# Altium project UmSELv1.PRJPCB
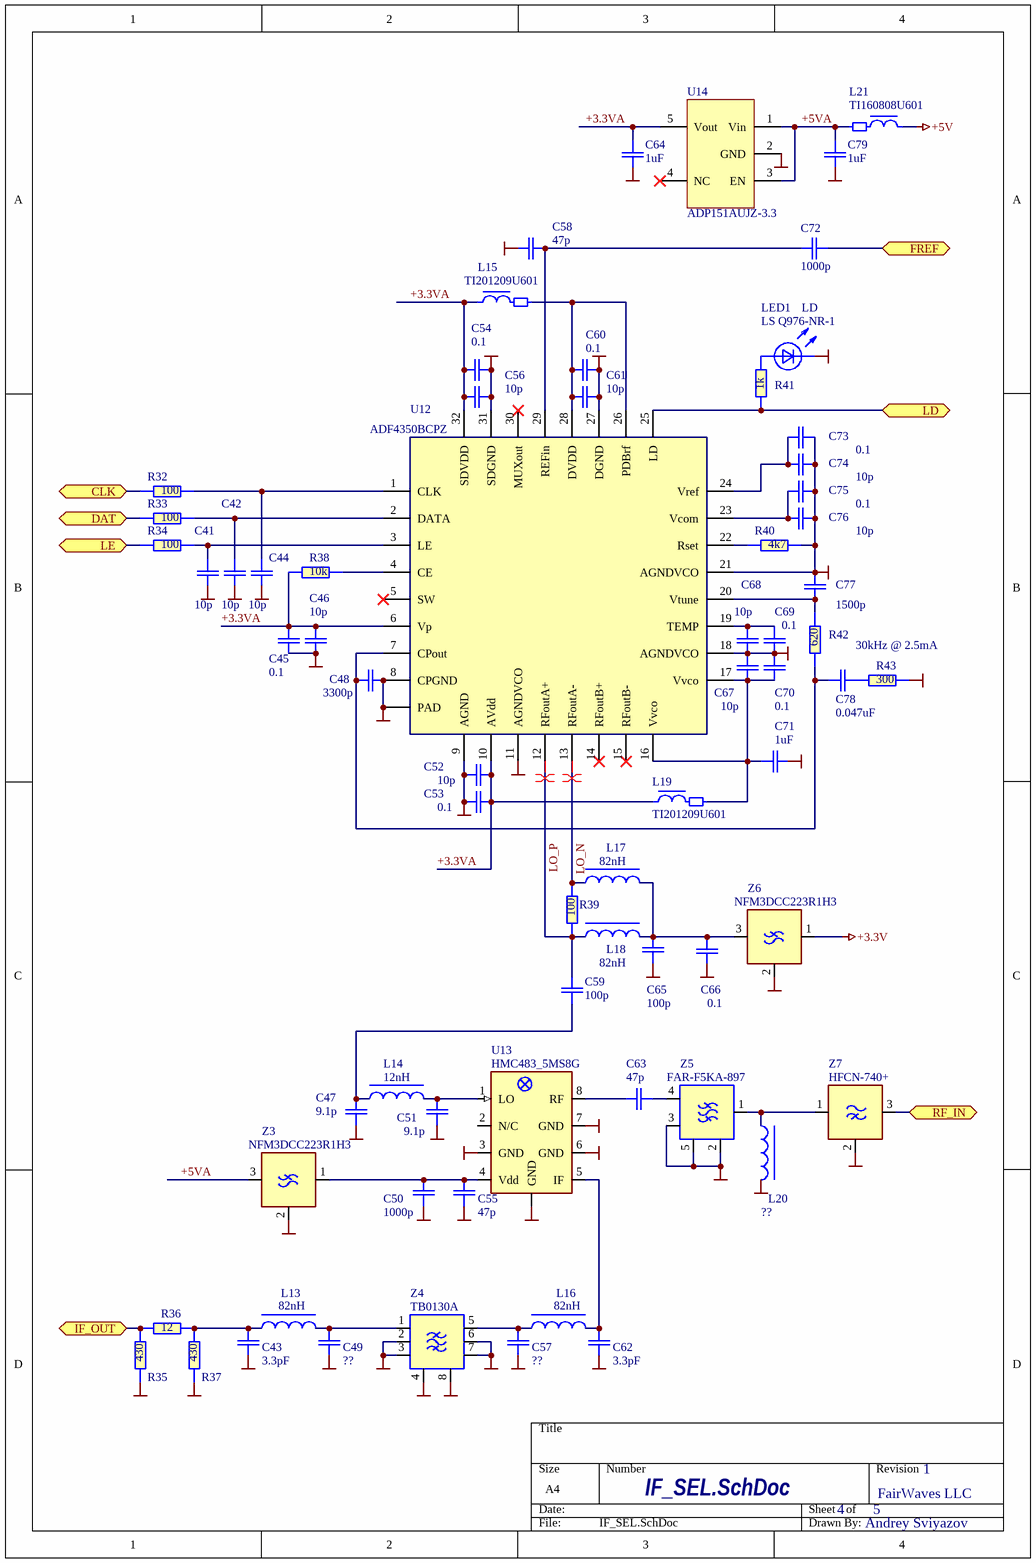
[diagram p0: IF_SEL.SchDoc]
3 sheets, 174 parts. Net scope: hierarchical (ports join the sheet entries above them; power ports are global).
Board file: UmSELv1.PcbDoc
Sheets:
  IF_SEL.SchDoc
  LNA_DIV.SchDoc
  Misc.SchDoc

## Sheet IF_SEL.SchDoc
size A4 portrait; CompanyName: FairWaves LLC; DrawnBy: Andrey Sviyazov; DocumentNumber: 4; Revision: 1; SheetNumber: 4; SheetTotal: 5

### Parts
C41  10p  [C0603-Phillips]
C42  10p  [C0603-Phillips]
C43  3.3pF  [C0603-Phillips]
C44  10p  [C0603-Phillips]
C45  0.1  [C0603-Phillips]
C46  10p  [C0603-Phillips]
C47  9.1p  [C0603-Phillips]
C48  3300p  [C0603-Phillips]
C49  ??  [C0603-Phillips]
C50  1000p  [C0603-Phillips]
C51  9.1p  [C0603-Phillips]
C52  10p  [C0603-Phillips]
C53  0.1  [C0603-Phillips]
C54  0.1  [C0603-Phillips]
C55  47p  [C0603-Phillips]
C56  10p  [C0603-Phillips]
C57  ??  [C0603-Phillips]
C58  47p  [C0603-Phillips]
C59  100p  [C0603-Phillips]
C60  0.1  [C0603-Phillips]
C61  10p  [C0603-Phillips]
C62  3.3pF  [C0603-Phillips]
C63  47p  [C0603-Phillips]
C64  1uF  [C0603-Phillips]
C65  100p  [C0603-Phillips]
C66  0.1  [C0603-Phillips]
C67  10p  [C0603-Phillips]
C68  10p  [C0603-Phillips]
C69  0.1  [C0603-Phillips]
C70  0.1  [C0603-Phillips]
C71  1uF  [C0603-Phillips]
C72  1000p  [C0603-Phillips]
C73  0.1  [C0603-Phillips]
C74  10p  [C0603-Phillips]
C75  0.1  [C0603-Phillips]
C76  10p  [C0603-Phillips]
C77  1500p  [C0603-Phillips]
C78  0.047uF  [C0603-Phillips]
C79  1uF  [C0603-Phillips]
L13  82nH  [TF160808-Phillips]
L14  12nH  [TF160808-Phillips]
L15  TI201209U601  [TI2012-Phillips]
L16  82nH  [TF160808-Phillips]
L17  82nH  [TF160808-Phillips]
L18  82nH  [TF160808-Phillips]
L19  TI201209U601  [TI2012-Phillips]
L20  ??  [TF160808-Phillips]
L21  TI160808U601  [Ti160808-Phillips]
LED1  LS Q976-NR-1  Misc: LD  [LED-0603y]
R32  100  [R0603-PHILLIPS]
R33  100  [R0603-PHILLIPS]
R34  100  [R0603-PHILLIPS]
R35  430  [R0603-PHILLIPS]
R36  12  [R0603-PHILLIPS]
R37  430  [R0603-PHILLIPS]
R38  10k  [R0603-PHILLIPS]
R39  100  [R0603-PHILLIPS]
R40  4k7  [R0603-PHILLIPS]
R41  1k  [R0603-PHILLIPS]
R42  620  [R0603-PHILLIPS]
R43  300  [R0603-PHILLIPS]
U12  ADF4350BCPZ  [CP-32-2]
U13  HMC483_5MS8G  [MS8G]
U14  ADP151AUJZ-3.3  [SOT-23-5[3.1x1.8/0.95]]
Z3  NFM3DCC223R1H3  [NFM3DC]
Z4  TB0130A  [DCC8_5x5]
Z5  FAR-F5KA-897  [SAW-1.4x1x0.5mm]
Z6  NFM3DCC223R1H3  [NFM3DC]
Z7  HFCN-740+  [LFCN-HFCN]

### Ports
CLK, DAT, FREF, IF_OUT, LD, LE, RF_IN

### Nets
+3.3V: Z6.1
+5V: L21.1
GND: C41.1 C42.1 C43.1 C44.1 C45.1 C46.1 C47.2 C48.1 C49.1 C50.2 C51.2 C52.2 C53.2 C54.2 C55.2 C56.2 C57.1 C58.1 C60.2 C61.2 C62.1 C64.1 C65.2 C66.1 C67.2 C68.1 C69.1 C70.2 C71.1 C73.2 C74.2 C75.2 C76.2 C77.2 C79.1 L20.2 LED1.1(K) R35.1 R37.1 R40.2 R43.2 U12.0(PAD) U12.8(CPGND) U12.9(AGND) U12.11(AGNDVCO) U12.18(AGNDVCO) U12.21(AGNDVCO) U12.27(DGND) U12.31(SDGND) U13.0(GND) U13.3(GND) U13.6(GND) U13.7(GND) U14.2(GND) Z3.2 Z4.2(In2) Z4.3(In3) Z4.4(Gnd) Z4.6(Out2) Z4.7(Out3) Z4.8(Gnd) Z5.2(GND) Z5.3(~{Out}) Z5.5(GND) Z6.2 Z7.2
+3.3VA: C45.2 C46.2 C52.1 C53.1 C54.1 C56.1 C64.2 L15.1 L19.1 R38.1 U12.6(Vp) U12.10(AVdd) U12.32(SDVDD) U14.5(Vout)
+5VA: C79.2 L21.2 U14.1(Vin) U14.3(EN) Z3.3
CLK: R32.1 ; port CLK
DAT: R33.1 ; port DAT
FREF: C72.2 ; port FREF
IF_OUT: R35.2 R36.1 ; port IF_OUT
LD: R41.1 U12.25(LD) ; port LD
LE: R34.1 ; port LE
LO_N: L17.1 R39.2 U12.13(RFoutA-)
LO_P: C59.1 L18.1 R39.1 U12.12(RFoutA+)
RF_IN: Z7.3 ; port RF_IN
NetC41_2: C41.2 R34.2 U12.3(LE)
NetC42_2: C42.2 R33.2 U12.2(DATA)
NetC43_2: C43.2 L13.1 R36.2 R37.2
NetC44_2: C44.2 R32.2 U12.1(CLK)
NetC47_1: C47.1 C59.2 L14.2
NetC48_2: C48.2 C78.2 R42.1 U12.7(CPout)
NetC49_2: C49.2 L13.2 Z4.1(IN1)
NetC50_1: C50.1 C55.1 U13.4(Vdd) Z3.1
NetC51_1: C51.1 L14.1 U13.1(LO)
NetC57_2: C57.2 L16.1 Z4.5(Out1)
NetC58_2: C58.2 C72.1 U12.29(REFin)
NetC60_1: C60.1 C61.1 L15.2 U12.26(PDBrf) U12.28(DVDD)
NetC62_2: C62.2 L16.2 U13.5(IF)
NetC63_1: C63.1 U13.8(RF)
NetC63_2: C63.2 Z5.4(Out)
NetC65_1: C65.1 C66.2 L17.2 L18.2 Z6.3
NetC67_1: C67.1 C70.1 C71.2 L19.2 U12.16(Vvco) U12.17(Vvco)
NetC68_2: C68.2 C69.2 U12.19(TEMP)
NetC73_1: C73.1 C74.1 U12.24(Vref)
NetC75_1: C75.1 C76.1 U12.23(Vcom)
NetC77_1: C77.1 R42.2 U12.20(Vtune)
NetC78_1: C78.1 R43.1
NetL20_1: L20.1 Z5.1(IN) Z7.1
NetLED1_2: LED1.2(A) R41.2
NetR38_2: R38.2 U12.4(CE)
NetR40_1: R40.1 U12.22(Rset)

Not connected (* = marked no-connect by the designer): U12 5(SW)* 14(RFoutB+)* 15(RFoutB-)* 30(MUXout)*; U13 2(N/C); U14 4(NC)*

### Layout directives
differential pair: LO_N, LO_P

### Notes on the sheet
- 30kHz @ 2.5mA

### Library data of the parts
C41-C44 C46-C52 C55-C59 C61-C63 C65 C67 C68 C72 C74 C76 C77 = C0603: Capacitor; Manufacturer: MURATA; Tolerance: 20%; Name: SMD0603; U/P/TKE: NP0
  C41 C42 C44 C46 C52 C56 C61 C67 C68 C74 C76: Value: 10p
  C43 C62: Value: 3.3pF
  C47 C51: Value: 9.1p
  C48: Value: 3300p
  C49 C57: Value: ??
  C50 C72: Value: 1000p
  C55 C58 C63: Value: 47p
  C59 C65: Value: 100p
  C77: Value: 1500p
C45 C53 C54 C60 C64 C66 C69-C71 C73 C75 C79 = C0603: Capacitor; Manufacturer: MURATA; Tolerance: 20%; Name: SMD0603; U/P/TKE: Y5V
  C45 C53 C54 C60 C66 C69 C70 C73 C75: Value: 0.1
  C64 C71 C79: Value: 1uF
C78 = C0603: Capacitor; Manufacturer: MURATA; Tolerance: 20%; Name: SMD0603; U/P/TKE: X5R; Value: 0.047uF
L13 L14 L16-L18 L20 = TF160808: Coil; Manufacturer: SMD; Name: TF160808
  L13 L16-L18: Value: 82nH
  L14: Value: 12nH
  L20: Value: ??
L15 L19 = TI2012_1: Choke; Manufacturer: MURATA; Name: TI201209U601; Value: *
L21 = TI160808: Choke; Manufacturer: MURATA; Name: TI160808U601; Value: *
LED1 = LED0603: LED SMD; Manufacturer: OSRAM Opto Semi; Name: LS Q976-NR-1
R32-R43 = R0603: Resistor; Manufacturer: YAGEO; Tolerance: 5%; Name: SMD0603; U/P/TKE: 0.1W
  R32-R34 R39: Value: 100
  R35 R37: Value: 430
  R36: Value: 12
  R38: Value: 10k
  R40: Value: 4k7
  R41: Value: 1k
  R42: Value: 620
  R43: Value: 300
U12 = ADF4350BCPZ: IC; Manufacturer: Analog Devices; Misc: RF Synthesizer with VCO; Swap: No; Name: ADF4350BCPZ
U13 = HMC483_5MS8G: IC; Manufacturer: Hittite; Swap: No; Misc: High IP3 Mixer with  LO Amp; Name: HMC483_5MS8G
U14 = ADP151AUJZ: IC; Manufacturer: AD; Name: ADP151AUJZ-3.3
Z3 Z6 = NFM3DC: EMI_FILTER; Manufacturer: Murata; Value: 22nF; PDF: D:\Proj\Components\Murata\EMI Suppression Filters.pdf; Name: NFM3DCC223R1H3; Misc: EMI_FILTER
Z4 = SAW 5x5-8 SMD: SAW filter; Manufacturer: Tai-SAW; Misc: Low-Loss IF Filter for Mobile Communication; Name: TB0130A
Z5 = SAW 1.4x1.0-5 SMD: SAW Filter; Manufacturer: Taiyo Yuden; Misc: Low-Loss Filter for Mobile Communication; Name: FAR-F5KA-897
Z7 = HFCN-2700: High pass filter; Manufacturer: MiniCircuits; Misc: HPF-740МГц; Name: HFCN-740+; Value: HFCN-740+

## Sheet LNA_DIV.SchDoc
size A4 portrait; CompanyName: FairWaves LLC; DrawnBy: Andrey Sviyazov; DocumentNumber: 3; Revision: 1; SheetNumber: 3; SheetTotal: 5
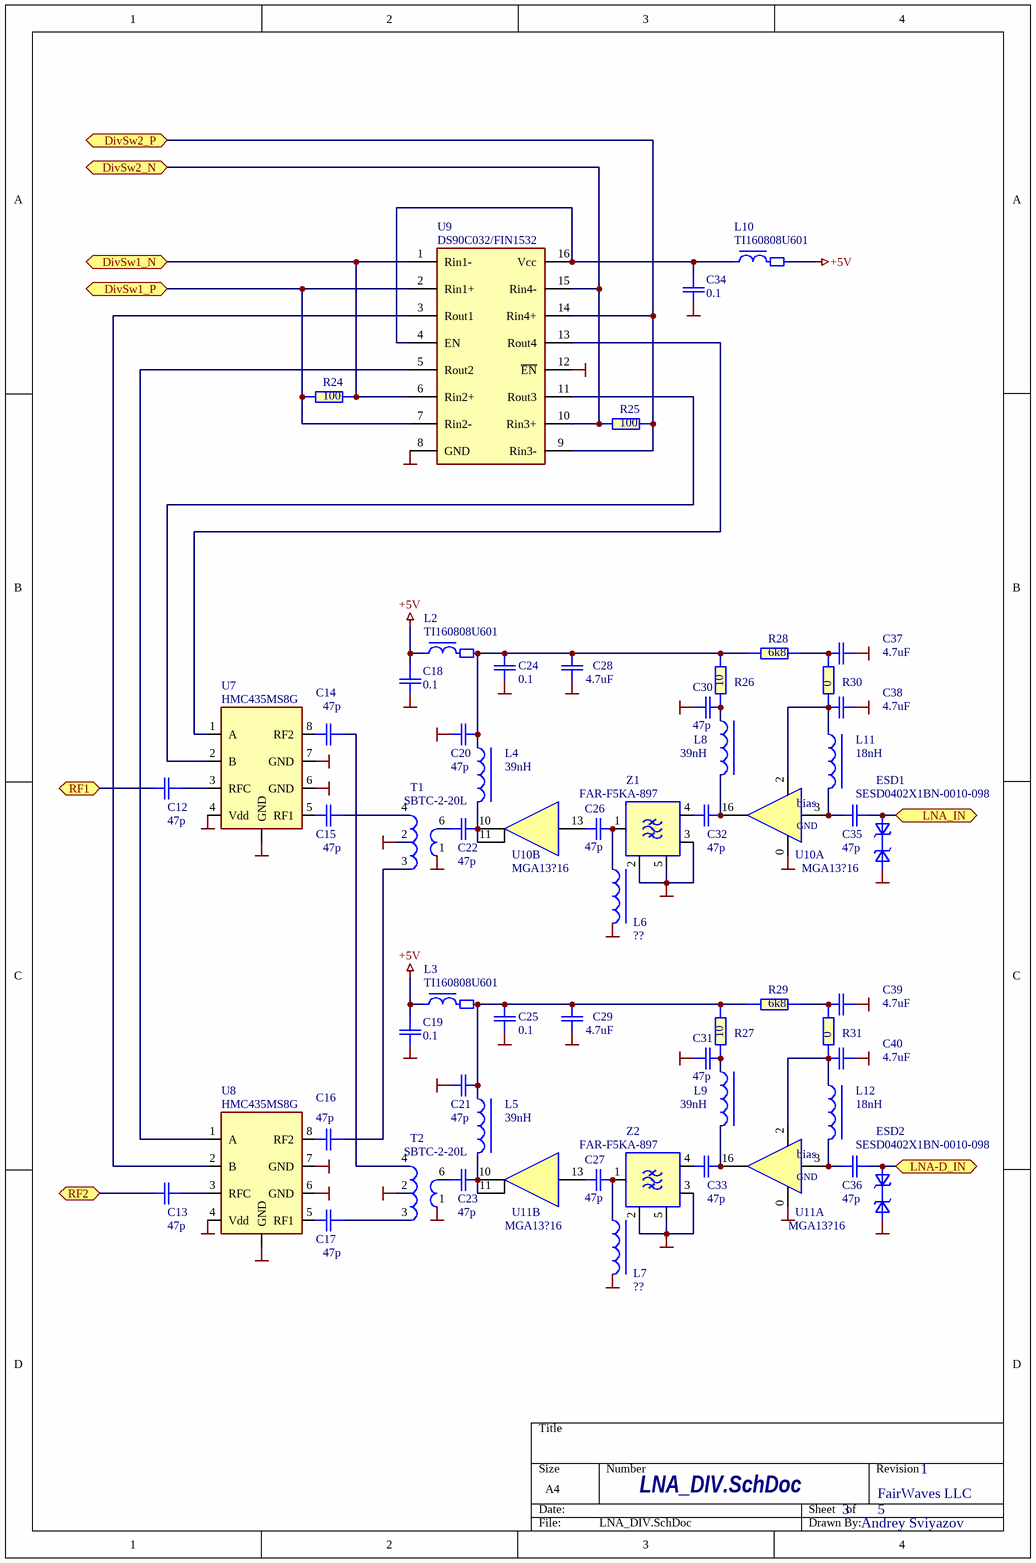
[diagram p1: LNA_DIV.SchDoc]

### Parts
C12  47p  [C0603-PHILLIPS]
C13  47p  [C0603-PHILLIPS]
C14  47p  [C0603-PHILLIPS]
C15  47p  [C0603-PHILLIPS]
C16  47p  [C0603-PHILLIPS]
C17  47p  [C0603-PHILLIPS]
C18  0.1  [C0603-Phillips]
C19  0.1  [C0603-Phillips]
C20  47p  [C0603-PHILLIPS]
C21  47p  [C0603-PHILLIPS]
C22  47p  [C0603-PHILLIPS]
C23  47p  [C0603-PHILLIPS]
C24  0.1  [C0603-Phillips]
C25  0.1  [C0603-Phillips]
C26  47p  [C0603-PHILLIPS]
C27  47p  [C0603-PHILLIPS]
C28  4.7uF  [C0603-Phillips]
C29  4.7uF  [C0603-Phillips]
C30  47p  [C0603-PHILLIPS]
C31  47p  [C0603-PHILLIPS]
C32  47p  [C0603-PHILLIPS]
C33  47p  [C0603-PHILLIPS]
C34  0.1  [C0603-Phillips]
C35  47p  [C0603-PHILLIPS]
C36  47p  [C0603-PHILLIPS]
C37  4.7uF  [C0603-Phillips]
C38  4.7uF  [C0603-Phillips]
C39  4.7uF  [C0603-Phillips]
C40  4.7uF  [C0603-Phillips]
ESD1  SESD0402X1BN-0010-098  [R0402-Phillips]
ESD2  SESD0402X1BN-0010-098  [R0402-Phillips]
L2  TI160808U601  [Ti160808-Phillips]
L3  TI160808U601  [Ti160808-Phillips]
L4  39nH  [TF160808-Phillips]
L5  39nH  [TF160808-Phillips]
L6  ??  [TF160808-Phillips]
L7  ??  [TF160808-Phillips]
L8  39nH  [TF160808-Phillips]
L9  39nH  [TF160808-Phillips]
L10  TI160808U601  [Ti160808-Phillips]
L11  18nH  [TF160808-Phillips]
L12  18nH  [TF160808-Phillips]
R24  100  [R0603-PHILLIPS]
R25  100  [R0603-PHILLIPS]
R26  10  [R0603-PHILLIPS]
R27  10  [R0603-PHILLIPS]
R28  6k8  [R0603-PHILLIPS]
R29  6k8  [R0603-PHILLIPS]
R30  0  [R0603-PHILLIPS]
R31  0  [R0603-PHILLIPS]
T1  SBTC-2-20L  [AT1030]
T2  SBTC-2-20L  [AT1030]
U7  HMC435MS8G  [MS8G]
U8  HMC435MS8G  [MS8G]
U9  DS90C032/FIN1532  [SOIC16]
U10  MGA13?16  [MGA13x16(GND NC Legs)]  (parts A,B of 2)
U11  MGA13?16  [MGA13x16(GND NC Legs)]  (parts A,B of 2)
Z1  FAR-F5KA-897  [SAW-1.4x1x0.5mm]
Z2  FAR-F5KA-897  [SAW-1.4x1x0.5mm]

### Ports
DivSw1_N, DivSw1_P, DivSw2_N, DivSw2_P, LNA-D_IN, LNA_IN, RF1, RF2

### Nets
+5V: C18.2 C19.2 L2.1 L3.1 L10.2
GND: C18.1 C19.1 C20.1 C21.1 C24.1 C25.1 C28.1 C29.1 C30.2 C31.2 C34.1 C37.2 C38.2 C39.2 C40.2 ESD1.1(A1) ESD2.1(A1) L6.2 L7.2 T1.1 T1.2 T2.1 T2.2 U7.0(GND) U7.4(Vdd) U7.6(GND) U7.7(GND) U8.0(GND) U8.4(Vdd) U8.6(GND) U8.7(GND) U9.8(GND) U9.12(~{EN}) U10.0(GND) U11.0(GND) Z1.2(GND) Z1.3(~{Out}) Z1.5(GND) Z2.2(GND) Z2.3(~{Out}) Z2.5(GND)
DivSw1_N: R24.2 U9.1(Rin1-) U9.6(Rin2+) ; port DivSw1_N
DivSw1_P: R24.1 U9.2(Rin1+) U9.7(Rin2-) ; port DivSw1_P
DivSw2_N: R25.1 U9.10(Rin3+) U9.15(Rin4-) ; port DivSw2_N
DivSw2_P: R25.2 U9.9(Rin3-) U9.14(Rin4+) ; port DivSw2_P
LNA-D_IN: C36.2 ESD2.2(A2) ; port LNA-D_IN
LNA_IN: C35.2 ESD1.2(A2) ; port LNA_IN
RF1: C12.1 ; port RF1
RF2: C13.1 ; port RF2
NetC12_2: C12.2 U7.3(RFC)
NetC13_2: C13.2 U8.3(RFC)
NetC14_1: C14.1 U7.8(RF2)
NetC14_2: C14.2 T2.4
NetC15_1: C15.1 U7.5(RF1)
NetC15_2: C15.2 T1.4
NetC16_1: C16.1 U8.8(RF2)
NetC16_2: C16.2 T1.3
NetC17_1: C17.1 U8.5(RF1)
NetC17_2: C17.2 T2.3
NetC20_2: C20.2 C24.2 C28.2 L2.2 L4.1 R26.2 R28.1
NetC21_2: C21.2 C25.2 C29.2 L3.2 L5.1 R27.2 R29.1
NetC22_1: C22.1 T1.6
NetC22_2: C22.2 L4.2 U10.10(Out2/VDD) U10.11(Out2/VDD)
NetC23_1: C23.1 T2.6
NetC23_2: C23.2 L5.2 U11.10(Out2/VDD) U11.11(Out2/VDD)
NetC26_1: C26.1 U10.13(In2)
NetC26_2: C26.2 L6.1 Z1.1(IN)
NetC27_1: C27.1 U11.13(In2)
NetC27_2: C27.2 L7.1 Z2.1(IN)
NetC30_1: C30.1 L8.1 R26.1
NetC31_1: C31.1 L9.1 R27.1
NetC32_1: C32.1 Z1.4(Out)
NetC32_2: C32.2 L8.2 U10.16(Out1/VDD)
NetC33_1: C33.1 Z2.4(Out)
NetC33_2: C33.2 L9.2 U11.16(Out1/VDD)
NetC34_2: C34.2 L10.1 U9.4(EN) U9.16(Vcc)
NetC35_1: C35.1 L11.2 U10.3(In1)
NetC36_1: C36.1 L12.2 U11.3(In1)
NetC37_1: C37.1 R28.2 R30.2
NetC38_1: C38.1 L11.1 R30.1 U10.2(BIAS)
NetC39_1: C39.1 R29.2 R31.2
NetC40_1: C40.1 L12.1 R31.1 U11.2(BIAS)
NetU7_1: U7.1(A) U9.13(Rout4)
NetU7_2: U7.2(B) U9.11(Rout3)
NetU8_1: U8.1(A) U9.5(Rout2)
NetU8_2: U8.2(B) U9.3(Rout1)

### Notes on the sheet
- (in symbol MGA13116, part A) bias

### Library data of the parts
C12-C17 C20-C23 C26 C27 C30-C33 C35 C36 = C0603: as C41 on sheet IF_SEL; Value: 47p
C18 C19 C24 C25 C28 C29 C34 C37-C40 = C0603: as C45 on sheet IF_SEL
  C18 C19 C24 C25 C34: Value: 0.1
  C28 C29 C37-C40: Value: 4.7uF
ESD1 ESD2 = SESD0402X: ESD diod bi-directional; Manufacturer: Tyco Electronics Corp; U/P/TKE: 9.8V; Name: SESD0402X1BN-0010-098
L2 L3 L10 = TI160808: Choke; Manufacturer: MURATA; Name: TI160808U601; Value: *
L4-L9 L11 L12 = TF160808: Coil; Manufacturer: SMD; Name: TF160808
  L4 L5 L8 L9: Value: 39nH
  L6 L7: Value: ??
  L11 L12: Value: 18nH
R24-R31 = R0603: as R32 on sheet IF_SEL
  R24 R25: Value: 100
  R26 R27: Value: 10
  R28 R29: Value: 6k8
  R30 R31: Value: 0
T1 T2 = SBTC-2-10L: Transformer; Manufacturer: Mini-Cirquits; Name: SBTC-2-20L
U7 U8 = HMC435MS8G: IC; Manufacturer: Hittite; Swap: No; Misc: RF SPDT Switch High Isolation Non Reflective; Name: HMC435MS8G
U9 = DS90C032: IC; Manufacturer: National/Fairchild; Swap: No; Misc: Quad LVDS Receiver; Name: DS90C032/FIN1532
U10 U11 = MGA13116: IC; Manufacturer: AVAGO; Misc: Low Noise Amplifier 2 stages; Swap: No; Name: MGA13?16
Z1 Z2 = SAW 1.4x1.0-5 SMD: as Z5 on sheet IF_SEL; Name: FAR-F5KA-897

## Sheet Misc.SchDoc
size A4 portrait; CompanyName: FairWaves LLC; DrawnBy: Andrey Sviyazov; DocumentNumber: 2; Revision: 1; SheetNumber: 2; SheetTotal: 5
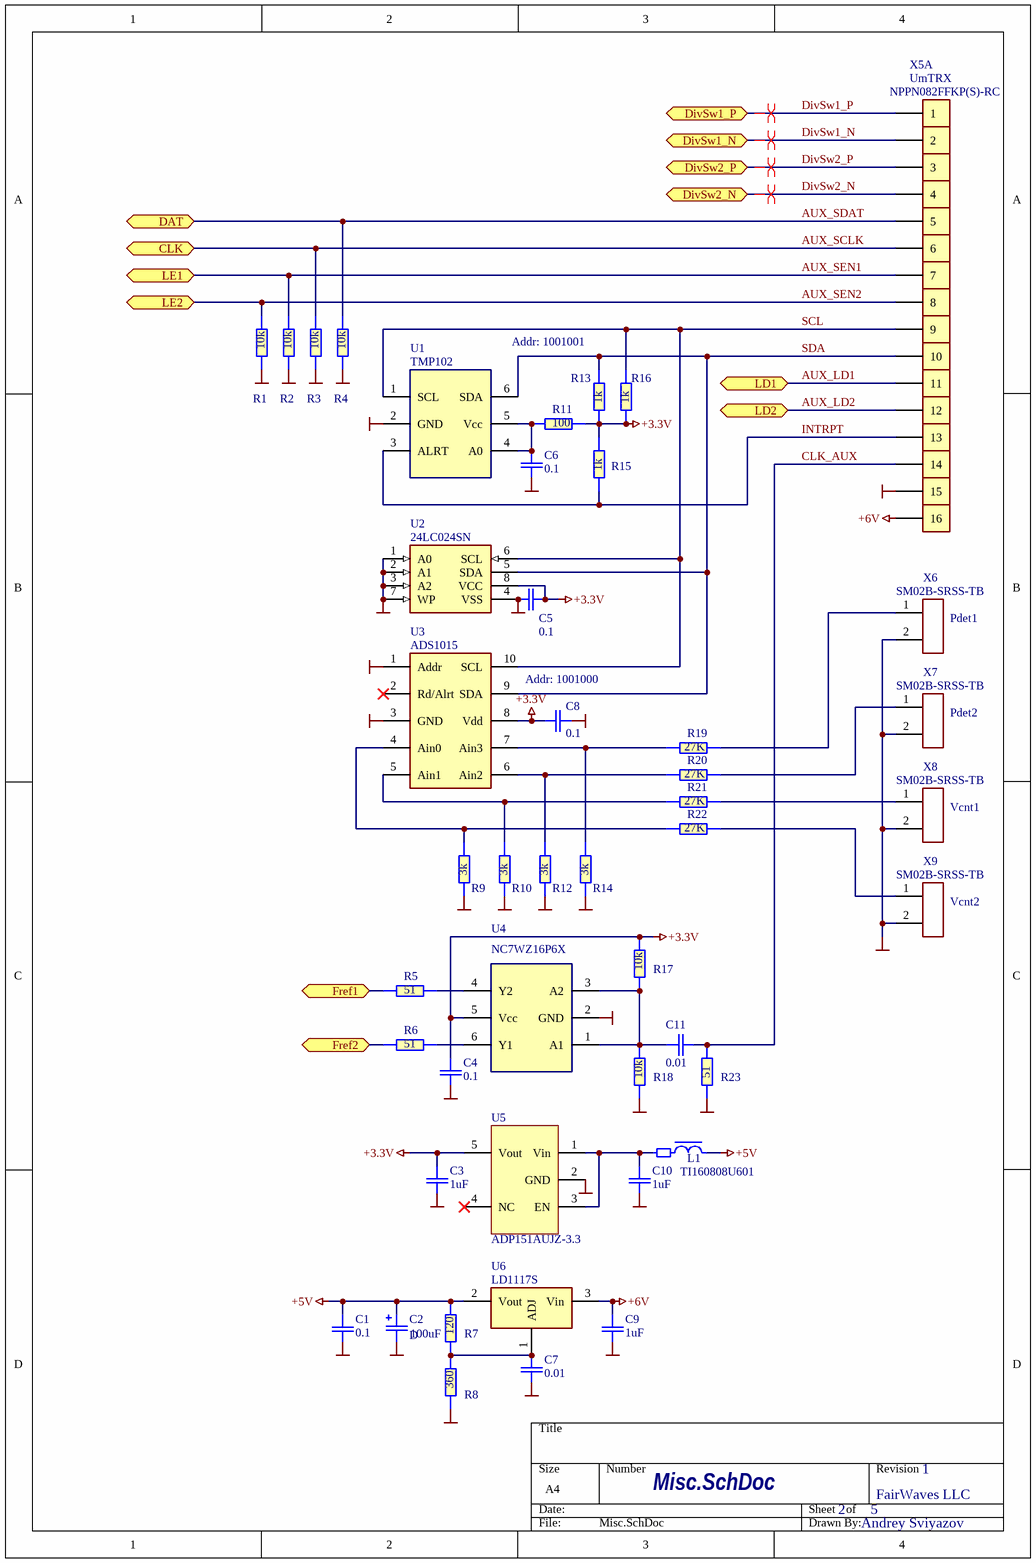
[diagram p2: Misc.SchDoc]

### Parts
C1  0.1  [C0603-Phillips]
C2  100uF  [cd7343]
C3  1uF  [C0603-Phillips]
C4  0.1  [C0603-Phillips]
C5  0.1  [C0603-Phillips]
C6  0.1  [C0603-Phillips]
C7  0.01  [C0603-Phillips]
C8  0.1  [C0603-Phillips]
C9  1uF  [C0603-Phillips]
C10  1uF  [C0603-Phillips]
C11  0.01  [C0603-Phillips]
L1  TI160808U601  [Ti160808-Phillips]
R1  10k  [R0603-PHILLIPS]
R2  10k  [R0603-PHILLIPS]
R3  10k  [R0603-PHILLIPS]
R4  10k  [R0603-PHILLIPS]
R5  51  [R0603-PHILLIPS]
R6  51  [R0603-PHILLIPS]
R7  120  [R0603-PHILLIPS]
R8  360  [R0603-PHILLIPS]
R9  3k  [R0603-PHILLIPS]
R10  3k  [R0603-PHILLIPS]
R11  100  [R0603-PHILLIPS]
R12  3k  [R0603-PHILLIPS]
R13  1k  [R0603-PHILLIPS]
R14  3k  [R0603-PHILLIPS]
R15  1k  [R0603-PHILLIPS]
R16  1k  [R0603-PHILLIPS]
R17  10k  [R0603-PHILLIPS]
R18  10k  [R0603-PHILLIPS]
R19  27K  [R0603-PHILLIPS]
R20  27K  [R0603-PHILLIPS]
R21  27K  [R0603-PHILLIPS]
R22  27K  [R0603-PHILLIPS]
R23  51  [R0603-PHILLIPS]
U1  TMP102  Addr: 1001001  [PDSO-G6]
U2  24LC024SN  [SOIC8]
U3  ADS1015  Addr: 1001000  [TSSOP-SPDSO-G10]
U4  NC7WZ16P6X  [SC70-6LD(SOT363)]
U5  ADP151AUJZ-3.3  [SOT-23-5[3.1x1.8/0.95]]
U6  LD1117S  [SOT-223-1]
X5  NPPN082FFKP(S)-RC  Misc: UmTRX  [NPPN082FFKP(S)]  (parts A,B,C,D,E,F,G,H,I,J,K,L,M,N,O,P of 16)
X6  SM02B-SRSS-TB  Misc: Pdet1  [SM02B-SRSS-TB]
X7  SM02B-SRSS-TB  Misc: Pdet2  [SM02B-SRSS-TB]
X8  SM02B-SRSS-TB  Misc: Vcnt1  [SM02B-SRSS-TB]
X9  SM02B-SRSS-TB  Misc: Vcnt2  [SM02B-SRSS-TB]

### Ports
CLK, DAT, DivSw1_N, DivSw1_P, DivSw2_N, DivSw2_P, Fref1, Fref2, LD1, LD2, LE1, LE2

### Nets
+3.3V: C3.2 C4.2 C5.2 C8.1 R11.2 R13.1 R15.2 R16.1 R17.1 U2.8(VCC) U3.8(Vdd) U4.5(Vcc) U5.5(Vout)
+5V: C1.2 C2.1(+) L1.1 R7.1 U6.2(Vout)
+6V: C9.2 U6.3(Vin) X5.16
GND: C1.1 C2.2(-) C3.1 C4.1 C5.1 C6.1 C7.1 C8.2 C9.1 C10.1 R1.1 R2.1 R3.1 R4.1 R8.2 R9.2 R10.2 R12.2 R14.2 R18.2 R23.2 U1.2(GND) U2.1(A0) U2.2(A1) U2.3(A2) U2.4(VSS) U2.7(WP) U3.1(Addr) U3.3(GND) U4.2(GND) U5.2(GND) X5.15 X6.2 X7.2 X8.2 X9.2
AUX_LD1: X5.11 ; port LD1
AUX_LD2: X5.12 ; port LD2
AUX_SCLK: R3.2 X5.6 ; port CLK
AUX_SDAT: R4.2 X5.5 ; port DAT
AUX_SEN1: R2.2 X5.7 ; port LE1
AUX_SEN2: R1.2 X5.8 ; port LE2
CLK_AUX: C11.1 R23.1 X5.14
DivSw1_N: X5.2 ; port DivSw1_N
DivSw1_P: X5.1 ; port DivSw1_P
DivSw2_N: X5.4 ; port DivSw2_N
DivSw2_P: X5.3 ; port DivSw2_P
Fref1: R5.1 ; port Fref1
Fref2: R6.1 ; port Fref2
INTRPT: R15.1 U1.3(ALRT) X5.13
SCL: R16.2 U1.1(SCL) U2.6(SCL) U3.10(SCL) X5.9
SDA: R13.2 U1.6(SDA) U2.5(SDA) U3.9(SDA) X5.10
NetC6_2: C6.2 R11.1 U1.4(A0) U1.5(Vcc)
NetC7_2: C7.2 R7.2 R8.1 U6.1(ADJ)
NetC10_2: C10.2 L1.2 U5.1(Vin) U5.3(EN)
NetC11_2: C11.2 R17.2 R18.1 U4.1(A1) U4.3(A2)
NetR5_2: R5.2 U4.4(Y2)
NetR6_2: R6.2 U4.6(Y1)
NetR9_1: R9.1 R22.1 U3.4(Ain0)
NetR10_1: R10.1 R21.1 U3.5(Ain1)
NetR12_1: R12.1 R20.1 U3.6(Ain2)
NetR14_1: R14.1 R19.1 U3.7(Ain3)
NetR19_2: R19.2 X6.1
NetR20_2: R20.2 X7.1
NetR21_2: R21.2 X8.1
NetR22_2: R22.2 X9.1

Not connected (* = marked no-connect by the designer): U3 2(Rd/Alrt)*; U5 4(NC)*

### Layout directives
differential pair: DivSw1_N, DivSw1_P, DivSw2_N, DivSw2_P

### Notes on the sheet
- (in symbol CD7343) D

### Library data of the parts
C1 C3-C11 = C0603: as C45 on sheet IF_SEL
  C1 C4-C6 C8: Value: 0.1
  C3 C9 C10: Value: 1uF
  C7 C11: Value: 0.01
C2 = CD7343: Capacitor; Manufacturer: SPRAGUE; Name: CASE-D; U/P/TKE: 16V; Value: 100uF
L1 = TI160808: Choke; Manufacturer: MURATA; Name: TI160808U601; Value: *
R1-R8 R11 R13 R15-R18 R23 = R0603: as R32 on sheet IF_SEL
  R1-R4 R17 R18: Value: 10k
  R5 R6 R23: Value: 51
  R7: Value: 120
  R8: Value: 360
  R11: Value: 100
  R13 R15 R16: Value: 1k
R9 R10 R12 R14 R19-R22 = R0603: Resistor; Manufacturer: YAGEO; Tolerance: 1%; Name: SMD0603; U/P/TKE: 0.1W
  R9 R10 R12 R14: Value: 3k
  R19-R22: Value: 27K
U1 = TMP102: IC; Manufacturer: TI; Misc: Temperature Sensor I2C; Name: TMP102
U2 = AT24CXX: EEPROM; Manufacturer: Microchip; Swap: No; Name: 24LC024SN
U3 = ADS1015: IC; Manufacturer: TI; Swap: No; Name: ADS1015
U4 = NC7WZ16P6X: IC; Manufacturer: Fairchild; Name: NC7WZ16P6X
U5 = ADP151AUJZ: IC; Manufacturer: AD; Name: ADP151AUJZ-3.3
U6 = LD1117ADJ: IC; Manufacturer: STMicro; Swap: No; Name: LD1117S
X5 = NPPN082FFKP(S): Connector female 2mm SMD; Manufacturer: Sullins; Name: NPPN082FFKP(S)-RC
X6-X9 = SM02B-SRSS-TB: Connector; Manufacturer: JST; Name: SM02B-SRSS-TB

## Nets that join several sheets
+3.3V: IF_SEL (Z6.1), Misc (13 pins)
+5V: IF_SEL (L21.1), LNA_DIV (5 pins), Misc (5 pins)
GND: IF_SEL (66 pins), LNA_DIV (41 pins), Misc (36 pins)

## Assembly variants
UmSELv1. GSM Preselector - full.: all parts fitted
UmSELv1. GSM 900 Preselector.: not fitted C37 C39 C41 C41" C42 C42" C44 C44" C49 C49" C57 C57" L6 L7 L20 L20"
UmSELv1. GSM 1800 Preselector.: not fitted C41 C41" C42 C42" C44 C44" C49 C49" C57 C57"